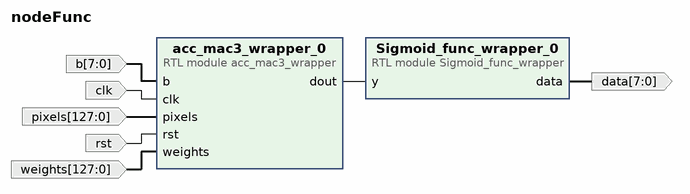
[diagram p0: block diagram of the top level]
# Vivado block design nodeFunc, xc7a35tcpg236-1, Vivado 2022.2
create_bd_design nodeFunc

create_bd_port -dir O -from 7 -to 0 data
create_bd_port -dir I -from 7 -to 0 b
create_bd_port -dir I -type clk clk
create_bd_port -dir I -from 127 -to 0 pixels
create_bd_port -dir I -type rst rst
create_bd_port -dir I -from 127 -to 0 weights

create_bd_cell -type module -reference Sigmoid_func_wrapper Sigmoid_func_wrapper_0
create_bd_cell -type module -reference acc_mac3_wrapper acc_mac3_wrapper_0

# ---- connections ----

connect_bd_net [get_bd_pins Sigmoid_func_wrapper_0/data] [get_bd_ports data]
connect_bd_net [get_bd_pins acc_mac3_wrapper_0/dout] [get_bd_pins Sigmoid_func_wrapper_0/y]
connect_bd_net -net b_0_1 [get_bd_ports b] [get_bd_pins acc_mac3_wrapper_0/b]
connect_bd_net -net clk_0_1 [get_bd_ports clk] [get_bd_pins acc_mac3_wrapper_0/clk]
connect_bd_net -net pixels_0_1 [get_bd_ports pixels] [get_bd_pins acc_mac3_wrapper_0/pixels]
connect_bd_net -net rst_0_1 [get_bd_ports rst] [get_bd_pins acc_mac3_wrapper_0/rst]
connect_bd_net -net weights_0_1 [get_bd_ports weights] [get_bd_pins acc_mac3_wrapper_0/weights]

validate_bd_design
save_bd_design
